# Altium schematic sheet BAT_TO_ADC.SchDoc
size A4
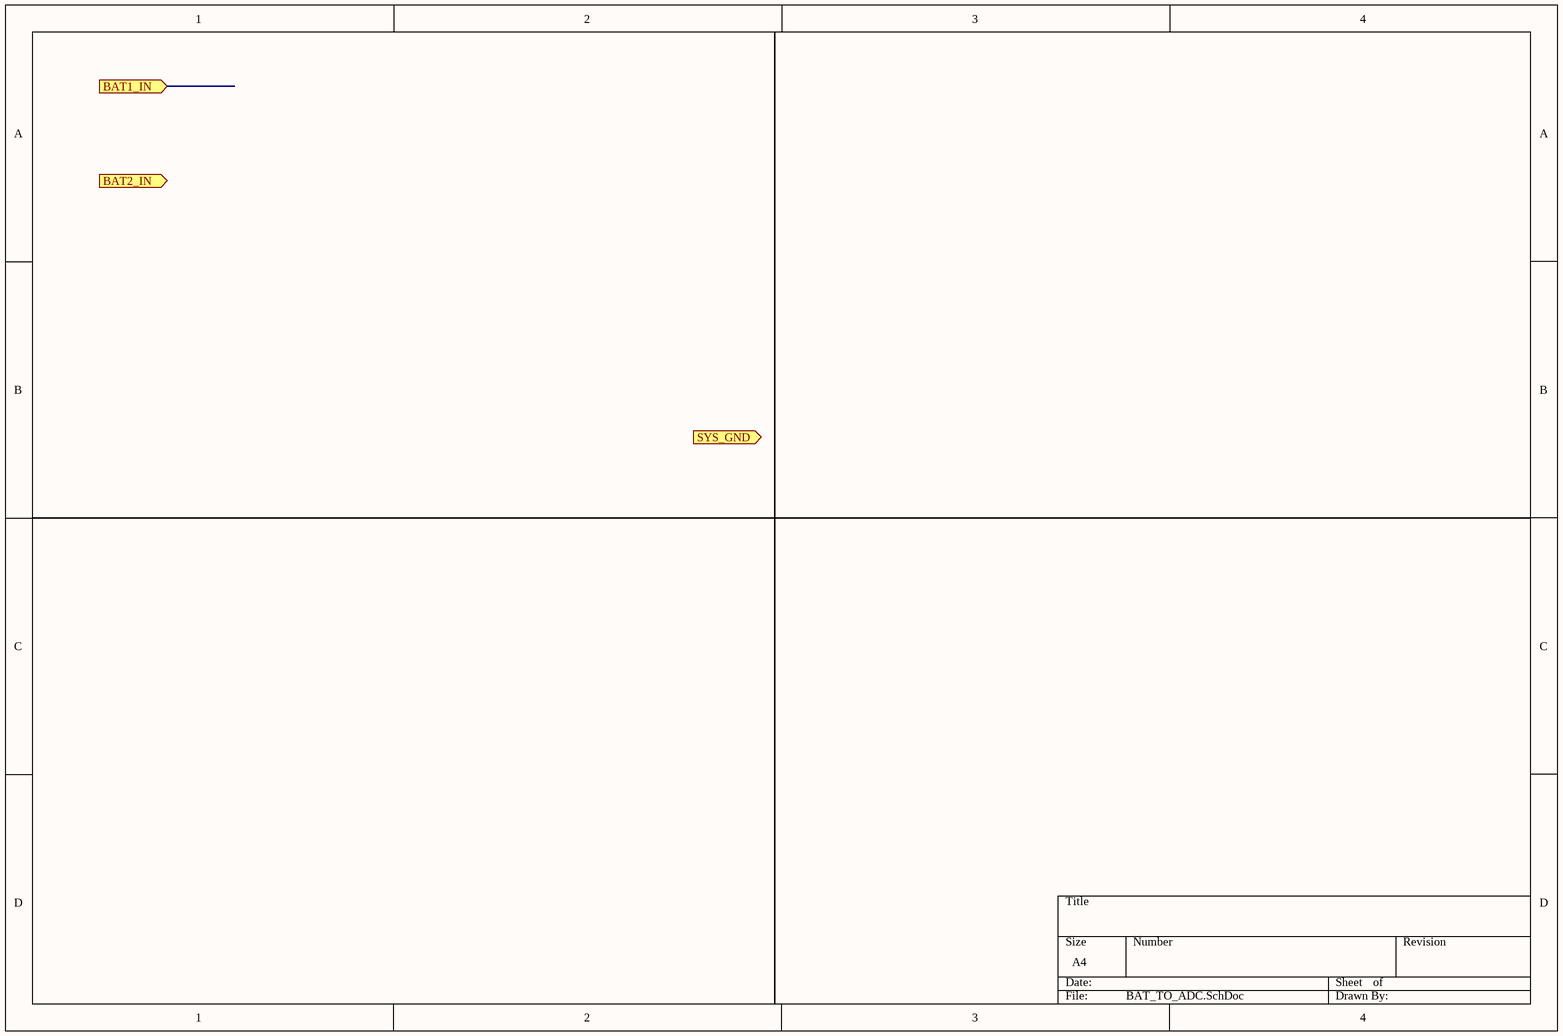
[diagram p0: BAT_TO_ADC.SchDoc]

## Ports
BAT1_IN (in), BAT2_IN (in), SYS_GND (in)